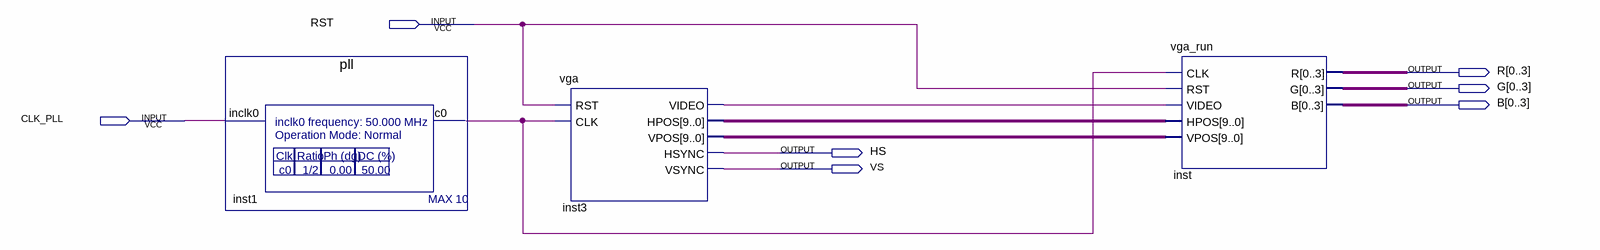
[diagram p0: schematic sheet]
// Quartus schematic practica-08.bdf as structural Verilog: 3 symbols, 7 pins
module \practica-08  (
  input  RST,
  input  CLK_PLL,
  output [0:3] R,
  output [0:3] G,
  output [0:3] B,
  output HS,
  output VS
);

  wire inst1_c0, inst3_video;
  wire [9:0] inst3_hpos, inst3_vpos;

  pll inst1 (.inclk0(CLK_PLL), .c0(inst1_c0));
  vga inst3 (
    .RST(RST), .CLK(inst1_c0), .VIDEO(inst3_video), .HPOS(inst3_hpos), .VPOS(inst3_vpos), .HSYNC(HS),
    .VSYNC(VS));
  vga_run inst (
    .CLK(inst1_c0), .RST(RST), .VIDEO(inst3_video), .HPOS(inst3_hpos), .VPOS(inst3_vpos), .R(R), .G(G), .B(B));
endmodule
